# EAGLE board led-controller-hw (EAGLE 7.5.0)
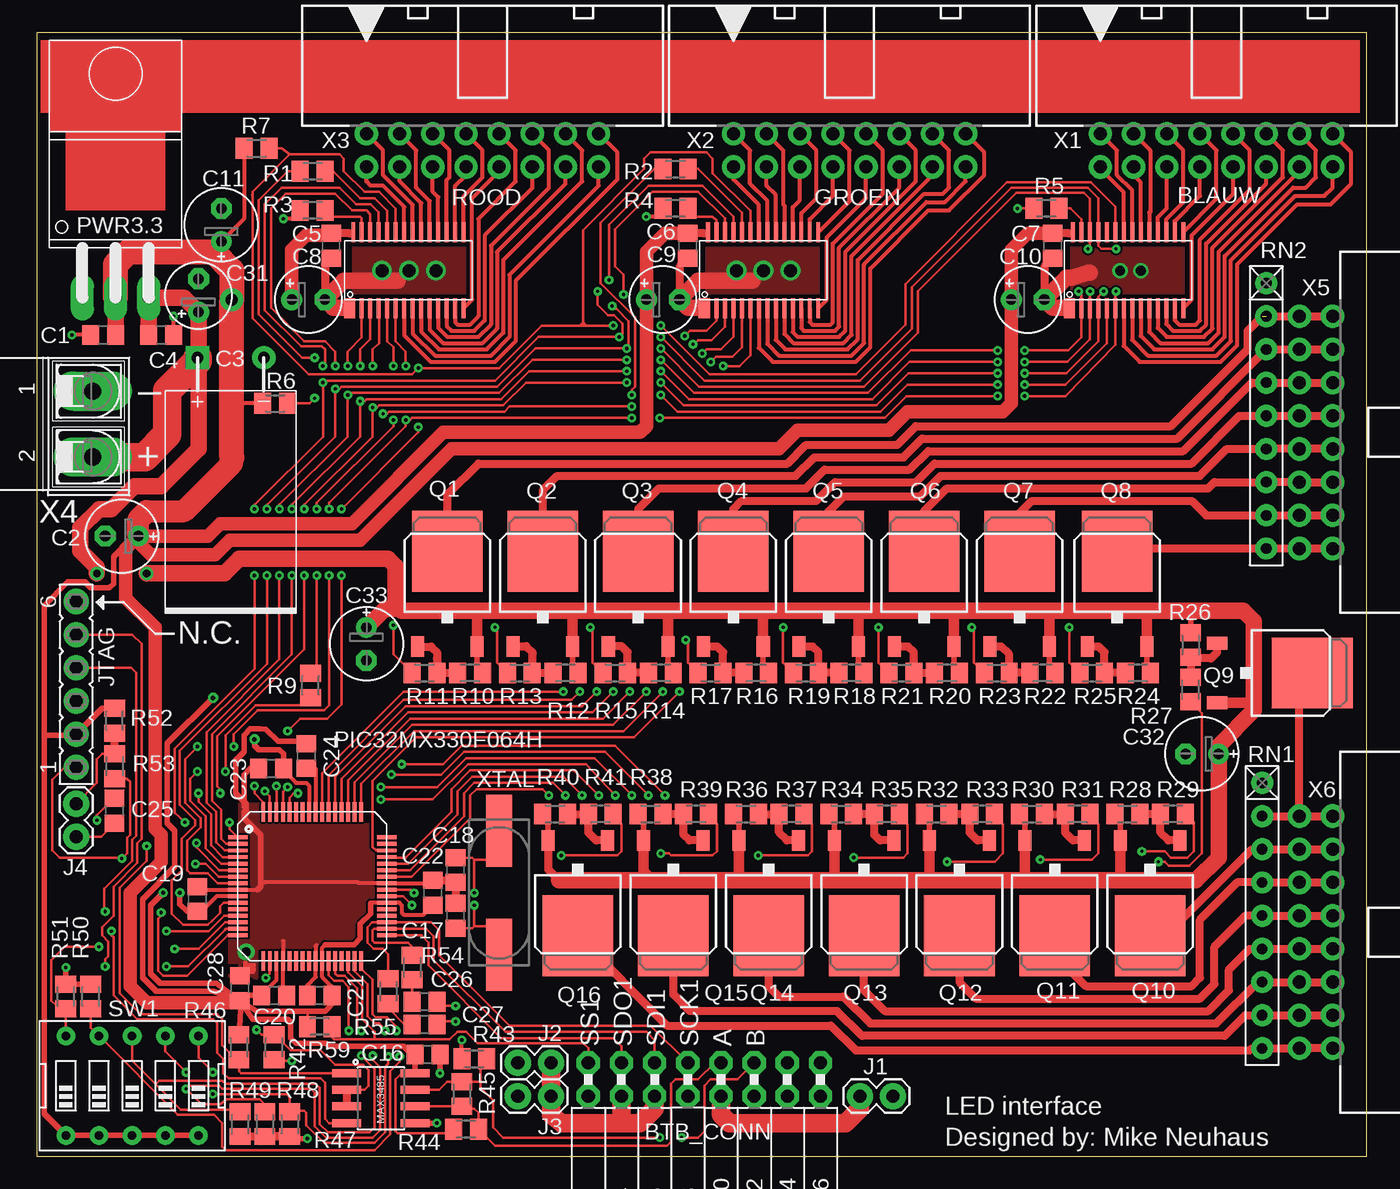
[diagram p2: board, top side]
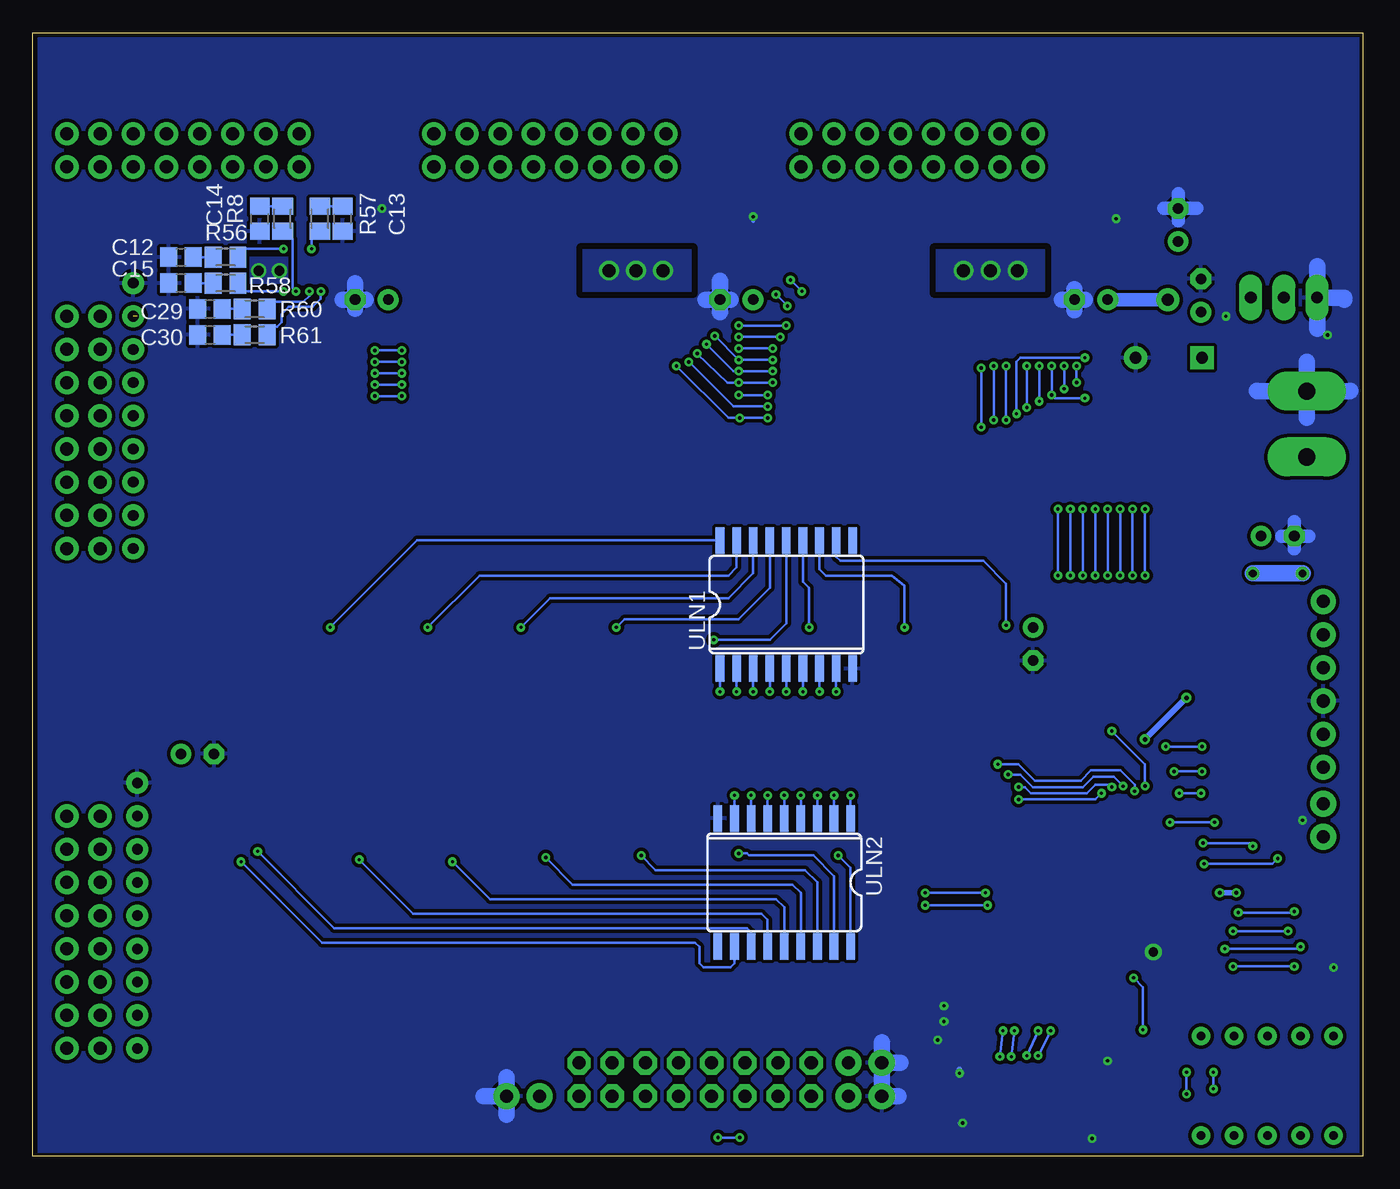
[diagram p3: board, bottom side, seen from below]

Size 101.84 x 86 mm. Coordinates in mm from the lower left corner, seen from the top.
Outline: 0,0 101.84,0 101.84,86 0,86 0,0
Copper layers (1*16): Top 0.035mm / dielectric 1.5mm / Bottom 0.035mm
Design rules "default *": minimum track width 0.15mm, minimum drill 0.25mm, track to track 0.15mm, track to pad 0.15mm, pad to pad 0.15mm, via to via 0.15mm, smd to smd 0.15mm, copper to edge 0.25mm, drill to drill 0.5mm, minimum pad ring 0.35mm, minimum via ring 8mil, stop-mask expansion 4mil, vias tented up to drill 0.25mm, thermal gap 10mil
bRestrict: 12 lines

## Footprints (pad centres in the part's own frame; a part is rotated, then mirrored left to right if it is on the bottom)
TSSOP-28-PWP = smd 1.55 x 0.85: 1 -0.65,9.375 | smd 1.55 x 0.3: 2 -0.65,8.45; 3 -0.65,7.8; 4 -0.65,7.15; 5 -0.65,6.5; 6 -0.65,5.85; 7 -0.65,5.2; 8 -0.65,4.55; 9 -0.65,3.9; 10 -0.65,3.25; 11 -0.65,2.6; 12 -0.65,1.95; 13 -0.65,1.3; 14 -0.65,0.65; 15 5.15,0.65; 16 5.15,1.3; 17 5.15,1.95; 18 5.15,2.6; 19 5.15,3.25; 20 5.15,3.9; 21 5.15,4.55; 22 5.15,5.2; 23 5.15,5.85; 24 5.15,6.5; 25 5.15,7.15; 26 5.15,7.8; 27 5.15,8.45; 28 5.15,9.1
FE08-2W = drill 1 pad 1.778 octagon: 1 -8.89,1.27; 2 -8.89,-1.27; 3 -6.35,1.27; 4 -6.35,-1.27; 5 -3.81,1.27; 6 -3.81,-1.27; 7 -1.27,1.27; 8 -1.27,-1.27; 9 1.27,1.27; 10 1.27,-1.27; 11 3.81,1.27; 12 3.81,-1.27; 13 6.35,1.27; 14 6.35,-1.27; 15 8.89,1.27; 16 8.89,-1.27
C0805 = smd 1.3 x 1.5: 1 -0.95,0; 2 0.95,0
E2,5-6E = drill 0.813 pad 1.575: + -1.27,0 | drill 0.813 pad 1.575 octagon: - 1.27,0
CPOL_EU10-27 = drill 0.9 pad 1.778 square: 1 7.54,-2.54 | drill 0.9 pad 1.778: 2 2.46,-2.54
E2,5-5 = drill 0.813 pad 1.6: + -1.27,0 | drill 0.813 pad 1.6 octagon: - 1.27,0
1X02_LOCK = drill 1 pad 2: 1 0,0; 2 2.54,0
FE06 = drill 1 pad 1.93: 1 -6.35,0; 2 -3.81,0; 3 -1.27,0; 4 1.27,0; 5 3.81,0; 6 6.35,0
SO08 = smd 0.61 x 2.21: 1 -1.905,-2.616; 2 -0.635,-2.616; 3 0.635,-2.616; 4 1.905,-2.616; 5 1.905,2.616; 6 0.635,2.616; 7 -0.635,2.616; 8 -1.905,2.616
TQFP-64-10 = smd 0.3 x 1.5: 1 1.95,0; 2 2.45,0; 3 2.95,0; 4 3.45,0; 5 3.95,0; 6 4.45,0; 7 4.95,0; 8 5.45,0; 9 5.95,0; 10 6.45,0; 11 6.95,0; 12 7.45,0; 13 7.95,0; 14 8.45,0; 15 8.95,0; 16 9.45,0; 33 9.45,11.4; 34 8.95,11.4; 35 8.45,11.4; 36 7.95,11.4; 37 7.45,11.4; 38 6.95,11.4; 39 6.45,11.4; 40 5.95,11.4; 41 5.45,11.4; 42 4.95,11.4; 43 4.45,11.4; 44 3.95,11.4; 45 3.45,11.4; 46 2.95,11.4; 47 2.45,11.4; 48 1.95,11.4 | smd 1.5 x 0.3: 17 11.4,1.95; 18 11.4,2.45; 19 11.4,2.95; 20 11.4,3.45; 21 11.4,3.95; 22 11.4,4.45; 23 11.4,4.95; 24 11.4,5.45; 25 11.4,5.95; 26 11.4,6.45; 27 11.4,6.95; 28 11.4,7.45; 29 11.4,7.95; 30 11.4,8.45; 31 11.4,8.95; 32 11.4,9.45; 49 0,9.45; 50 0,8.95; 51 0,8.45; 52 0,7.95; 53 0,7.45; 54 0,6.95; 55 0,6.45; 56 0,5.95; 57 0,5.45; 58 0,4.95; 59 0,4.45; 60 0,3.95; 61 0,3.45; 62 0,2.95; 63 0,2.45; 64 0,1.95
TO-220 = drill 0.9 pad 1.778 long: 1 0,0; 2 2.54,0; 3 5.08,0
D-PAK_TO252AA = smd 1 x 1.6: 1 -2.28,-4.8; 3 2.28,-4.8 | smd 5.4 x 6.2: 4 0,2.5
M0805 = smd 1.3 x 1.6: 1 -0.95,0; 2 0.95,0
RN-9 = drill 0.813 pad 1.676: 1 -10.16,0; 2 -7.62,0; 3 -5.08,0; 4 -2.54,0; 5 0,0; 6 2.54,0; 7 5.08,0; 8 7.62,0; 9 10.16,0
EDG-05 = drill 0.65 pad 1.422: 1 -5.08,-3.81; 2 -2.54,-3.81; 3 0,-3.81; 4 2.54,-3.81; 5 5.08,-3.81; 6 5.08,3.81; 7 2.54,3.81; 8 0,3.81; 9 -2.54,3.81; 10 -5.08,3.81
SO18L = smd 0.66 x 2.032: 1 -0.635,-4.902; 2 0.635,-4.902; 3 1.905,-4.902; 4 3.175,-4.902; 5 4.445,-4.902; 6 5.715,-4.902; 7 6.985,-4.902; 8 8.255,-4.902; 9 9.525,-4.902; 10 9.525,4.902; 11 8.255,4.902; 12 6.985,4.902; 13 5.715,4.902; 14 4.445,4.902; 15 3.175,4.902; 16 1.905,4.902; 17 0.635,4.902; 18 -0.635,4.902
PAK100/2500-5-16 = drill 1 pad 1.778: 1 -8.89,-1.27; 2 -8.89,1.27; 3 -6.35,-1.27; 4 -6.35,1.27; 5 -3.81,-1.27; 6 -3.81,1.27; 7 -1.27,-1.27; 8 -1.27,1.27; 9 1.27,-1.27; 10 1.27,1.27; 11 3.81,-1.27; 12 3.81,1.27; 13 6.35,-1.27; 14 6.35,1.27; 15 8.89,-1.27; 16 8.89,1.27
AK500/2-H = drill 1.321 pad 3 long: 1 -2.515,0; 2 2.515,0
CSM-7X-DU = smd 5.5 x 2: 1 -4.75,0; 2 4.75,0

## Placement (x,y rotation side)
BLAUW  [TSSOP-28-PWP]  88.42,65.56 90 top
BTB_CONN  [FE08-2W]  51.12,5.87 0 top
C1  100nF  [C0805]  5.08,62.87 180 top
C2  220uF  [E2,5-6E]  6.51,47.47 180 top
C3  680uF  [CPOL_EU10-27]  19.84,58.58 180 top
C4  100nF  [C0805]  9.53,62.87 0 top
C5  100nF  [C0805]  22.54,69.69 270 top
C6  100nF  [C0805]  49.85,69.69 270 top
C7  100nF  [C0805]  77.79,69.69 270 top
C8  1uF  [E2,5-5]  20.8,65.56 0 top
C9  1uF  [E2,5-5]  47.94,65.56 0 top
C10  1uF  [E2,5-5]  75.88,65.56 0 top
C11  220uF  [E2,5-6E]  14.13,71.28 90 top
C12  n.t.b.  [C0805]  90.49,68.82 180 bottom
C13  n.t.b.  [C0805]  78.11,71.75 270 bottom
C14  n.t.b.  [C0805]  84.45,71.75 270 bottom
C15  n.t.b.  [C0805]  90.49,66.83 180 bottom
C16  100nF  [C0805]  29.92,7.78 0 top
C17  22pF  [C0805]  32.07,18.41 270 top
C18  22pF  [C0805]  32.07,21.91 90 top
C19  100nF  [C0805]  12.3,19.68 90 top
C20  100nF  [C0805]  18.18,12.3 0 top
C21  100nF  [C0805]  21.67,12.3 180 top
C22  100nF  [C0805]  30.32,20.16 90 top
C23  100nF  [C0805]  17.94,29.69 180 top
C24  10uF - tantalum/keramisch  [C0805]  20.64,30.64 90 top
C25  100nF  [C0805]  5.95,26.43 90 top
C26  n.t.b.  [C0805]  29.69,11.83 0 top
C27  n.t.b.  [C0805]  29.69,10.08 0 top
C28  10uF/Ker  [C0805]  15.56,12.86 90 top
C29  n.t.b.  [C0805]  88.27,64.85 180 bottom
C30  n.t.b.  [C0805]  88.27,62.87 180 bottom
C31  1uF  [E2,5-5]  12.38,65.88 90 top
C32  220uF  [E2,5-6E]  89.22,30.8 180 top
C33  220uF  [E2,5-6E]  25.24,39.21 270 top
GROEN  [TSSOP-28-PWP]  60.48,65.56 90 top
J1  [1X02_LOCK]  65.56,4.6 180 top
J2  [1X02_LOCK]  39.37,7.14 180 top
J3  [1X02_LOCK]  39.37,4.6 180 top
J4  [1X02_LOCK]  3.02,24.45 90 top
JTAG  [FE06]  3.02,36.12 90 top
MAX3485  RS485SOIC  [SO08]  26.35,4.45 270 top
PIC32MX330F064H  [TQFP-64-10]  15.4,26.35 270 top
PWR3.3  3.3V/3A  [TO-220]  3.49,65.72 0 top
Q1  IRFR5305  [D-PAK_TO252AA]  31.43,43.81 0 top
Q2  IRFR5305  [D-PAK_TO252AA]  38.73,43.81 0 top
Q3  IRFR5305  [D-PAK_TO252AA]  46.04,43.81 0 top
Q4  IRFR5305  [D-PAK_TO252AA]  53.34,43.81 0 top
Q5  IRFR5305  [D-PAK_TO252AA]  60.64,43.81 0 top
Q6  IRFR5305  [D-PAK_TO252AA]  67.95,43.81 0 top
Q7  IRFR5305  [D-PAK_TO252AA]  75.25,43.81 0 top
Q8  IRFR5305  [D-PAK_TO252AA]  82.71,43.81 0 top
Q9  IRFR5305  [D-PAK_TO252AA]  95.17,36.99 270 top
Q10  IRFR5305  [D-PAK_TO252AA]  85.25,19.37 180 top
Q11  IRFR5305  [D-PAK_TO252AA]  77.95,19.37 180 top
Q12  IRFR5305  [D-PAK_TO252AA]  70.64,19.37 180 top
Q13  IRFR5305  [D-PAK_TO252AA]  63.34,19.37 180 top
Q14  IRFR5305  [D-PAK_TO252AA]  56.04,19.37 180 top
Q15  IRFR5305  [D-PAK_TO252AA]  48.74,19.37 180 top
Q16  IRFR5305  [D-PAK_TO252AA]  41.43,19.37 180 top
R1  n.t.b.  [M0805]  21.11,75.41 180 top
R2  n.t.b.  [M0805]  48.9,75.56 180 top
R3  1k9  [M0805]  21.11,72.39 0 top
R4  1k9  [M0805]  48.9,72.55 0 top
R5  1k9  [M0805]  77.31,72.55 0 top
R6  10k  [M0805]  18.26,57.63 180 top
R7  100k  [M0805]  16.83,77.15 180 top
R8  n.t.b.  [M0805]  82.71,71.75 270 bottom
R9  n.t.b.  [M0805]  20.95,36.04 270 top
R10  10k  [M0805]  33.18,36.99 0 top
R11  180  [M0805]  29.69,36.99 180 top
R12  10k  [M0805]  40.48,36.99 0 top
R13  180  [M0805]  36.99,36.99 180 top
R14  10k  [M0805]  47.78,36.99 0 top
R15  180  [M0805]  44.29,36.99 180 top
R16  10k  [M0805]  55.09,36.99 0 top
R17  180  [M0805]  51.59,36.99 180 top
R18  10k  [M0805]  62.39,36.99 0 top
R19  180  [M0805]  58.9,36.99 180 top
R20  10k  [M0805]  69.69,36.99 0 top
R21  180  [M0805]  66.2,36.99 180 top
R22  10k  [M0805]  76.99,36.99 0 top
R23  180  [M0805]  73.5,36.99 180 top
R24  10k  [M0805]  84.3,36.99 0 top
R25  180  [M0805]  80.8,36.99 180 top
R26  10k  [M0805]  88.34,39.13 90 top
R27  180  [M0805]  88.34,35.72 270 top
R28  10k  [M0805]  83.5,26.19 180 top
R29  180  [M0805]  87,26.19 0 top
R30  10k  [M0805]  76.2,26.19 180 top
R31  180  [M0805]  79.69,26.19 0 top
R32  10k  [M0805]  68.9,26.19 180 top
R33  180  [M0805]  72.39,26.19 0 top
R34  10k  [M0805]  61.59,26.19 180 top
R35  180  [M0805]  65.09,26.19 0 top
R36  10k  [M0805]  54.29,26.19 180 top
R37  180  [M0805]  57.79,26.19 0 top
R38  10k  [M0805]  46.99,26.19 180 top
R39  180  [M0805]  50.48,26.19 0 top
R40  10k  [M0805]  39.69,26.19 180 top
R41  180  [M0805]  43.18,26.19 0 top
R42  10k  [M0805]  18.18,8.33 270 top
R43  22k  [M0805]  33.5,7.46 180 top
R44  22k  [M0805]  32.86,2.06 0 top
R45  120  [M0805]  32.54,4.76 90 top
R46  10k  [M0805]  15.48,8.33 90 top
R47  100k  [M0805]  19.37,2.46 90 top
R48  100k  [M0805]  17.46,2.46 90 top
R49  100k  [M0805]  15.56,2.46 90 top
R50  100k  [M0805]  4.13,12.22 270 top
R51  100k  [M0805]  2.22,12.22 270 top
R52  10k  [M0805]  5.95,33.34 270 top
R53  1k  [M0805]  5.95,29.84 90 top
R54  n.t.b.  [M0805]  28.73,14.45 90 top
R55  n.t.b.  [M0805]  26.91,12.62 90 top
R56  n.t.b.  [M0805]  87.07,68.82 0 bottom
R57  n.t.b.  [M0805]  79.85,71.75 270 bottom
R58  n.t.b.  [M0805]  87.07,66.83 0 bottom
R59  100k  [M0805]  21.67,9.92 0 top
R60  n.t.b.  [M0805]  84.85,64.85 0 bottom
R61  n.t.b.  [M0805]  84.85,62.87 0 bottom
RN1  [RN-9]  93.82,18.41 270 top
RN2  [RN-9]  94.14,56.67 270 top
ROOD  [TSSOP-28-PWP]  33.34,65.56 90 top
SW1  [EDG-05]  7.3,5.4 0 top
ULN1  [SO18L]  48.58,42.23 0 bottom
ULN2  [SO18L]  39.85,20.95 180 bottom
X1  2516-5  [PAK100/2500-5-16]  90.33,76.99 0 top
X2  2516-5  [PAK100/2500-5-16]  62.23,76.99 0 top
X3  2516-5  [PAK100/2500-5-16]  34.13,76.99 0 top
X4  [AK500/2-H]  4.29,56.04 270 top
X5  2516-5  [PAK100/2500-5-16]  97.95,55.4 270 top
X6  2516-5  [PAK100/2500-5-16]  97.95,17.14 270 top
XTAL  8MHz  [CSM-7X-DU]  35.4,20.16 270 top

## Tracks (layer width: path | path; a pad name or v marks a point on that pad's centre or on a via)
!SS1
  Top 0.203: BTB_CONN.1 42.23,8.26 41.83,8.65 33.73,8.65 32.86,9.53 32.23,9.53 31.59,8.97 25.96,8.97 | 25.8,8.97 22.78,8.97 22.62,9.13 R59.2 | PIC32MX330F064H.30 23.85,14.09 24.92,13.02 24.92,10.48 25.88,9.53 25.88,9.05 | 25.96,8.97 25.88,9.05 | 25.88,9.05 25.8,8.97 | 25.8,8.97 25.96,8.97
+3V3  (via drill 0.3, 0.35, 0.9 pad 1.78)
  Top 0.203: R59.1 20.72,11.11 | R44.1 31.59,1.75 27.62,1.75 27.46,1.91 27.46,5.87 27.94,6.35 MAX3485.8
  Top 0.3: C22.1 29.6,18.49 28.1,18.49 27.94,18.65 27.94,19.21 27.75,19.4 PIC32MX330F064H.38 25.59,19.4 25.56,19.37 | BLAUW.28 79.29,70.71 79.22,70.64 | 51.31,70.64 GROEN.28 | 19.84,28.57 20.64,28.57 | C21.1 23.02,12.54 21.85,13.71 PIC32MX330F064H.26 21.85,15.97 22.07,16.19 | R7.2 15.88,71.76 C11.+ | R6.2 14.92,57.63 | C20.1 17.31,12.46 18.35,13.5 PIC32MX330F064H.19 | C19.1 12.7,19.05 12.94,19.05 13.79,19.9 PIC32MX330F064H.10 | 20.85,28.36 PIC32MX330F064H.57
  Top 0.305: ROOD.28 24.2,70.71 24.13,70.64 | C23.1 18.89,29.53 19.84,28.57 | 20.64,28.57 20.85,28.36
  Top 0.406: 79.22,70.64 79.06,70.64 | 51.31,70.64 51.12,70.64 | 24.13,70.64 23.97,70.64 | C21.1 22.86,11.9 22.07,11.11 20.72,11.11 16.83,11.11 C28.1 | v9.68,20.16 8.73,19.21 8.73,13.97 9.45,13.26 13.73,13.26 C28.1 | v13.49,35.08 10,31.59 10,25.48 10.56,24.92 10.56,22.15 8.1,19.68 8.1,13.65 9.13,12.62 13.49,12.62 C28.1 | C28.1 16.03,12.3 C20.1 | 16.03,11.91 C28.1 | 15.56,11.43 C28.1 | MAX3485.8 28.97,7.71 C16.1 28.65,7.86 28.1,8.41 22.38,8.41 22.15,8.65 19.84,8.65 19.45,9.05 19.45,10.24 19.21,10.48 16.51,10.48 C28.1 | R46.2 15.64,11.83 C28.1 | SW1.5 SW1.4 SW1.3 SW1.2 SW1.1 0.56,3.25 0.56,32.23 | 0.56,32.23 0.56,42.15 2.38,43.97 3.65,43.97 4.13,43.5 5.56,43.5 5.87,43.81 5.87,45.88 7.46,47.47 C2.+ | v10.95,20.16 10.95,19.29 11.51,18.73 C19.1 | R52.1 5,34.29 JTAG.2 2.94,32.23 0.56,32.23 | 22.07,16.19 24.29,16.19 24.77,16.67 24.77,17.78 25.56,18.57 25.56,19.37 | v16.67,31.91 16.67,31.43 16.99,31.11 18.57,31.11 18.89,30.8 C23.1
  Top 0.41: C23.1
  Top 0.61: 79.06,70.64 C7.1 | 51.12,70.64 C6.1 | 23.97,70.64 C5.1 22.54,70.48
  Top 1.016: C7.1 75.88,70.64 74.61,69.37 C10.+ 74.61,57.63 73.98,56.99 66.68,56.99 65.25,55.56 58.26,55.56 56.83,54.13 31.75,54.13 24.77,47.15 14.76,47.15 13.65,46.04 8.73,46.04 7.78,46.99 C2.+ | C6.1 48.1,70.64 46.67,69.22 C9.+ 46.67,55.88 46.2,55.4 31.12,55.4 24.13,48.42 14.05,48.42 13.1,47.47 C2.+ | 22.54,70.48 20.64,70.48 19.53,69.37 C8.+ | C2.+ 6.83,46.51 6.83,42.7 9.05,40.48 9.05,25.08 9.53,24.61 9.53,22.54 7.14,20.16 7.14,13.02 8.41,11.75 15.4,11.75 C28.1
  Top 1.27: PWR3.3.2 C1.1 | C11.+ 13.57,69.45 13.57,69.14
  Top 1.676: C2.+ 7.78,48.74 8.41,49.37 11.27,49.37 14.92,53.02 14.92,53.5
  Top 1.93: PWR3.3.2 6.03,68.26 6.99,69.22 13.49,69.22 13.57,69.14 14.92,67.79 v14.92,65.56 14.92,57.63 14.92,53.5
  Bottom 0.406: v10.95,20.16 v9.68,20.16
  Bottom 0.41: v13.49,35.08 v16.67,31.91
  Bottom 1.016: C8.+ v14.92,65.56
+5V  (via drill 0.6 pad 1.02)
  Top 0.406: Q1.3 33.71,37.41 arc90 R10.2 | Q2.3 41.02,37.41 arc90 R12.2 | Q3.3 48.32,37.41 arc90 R14.2 | Q4.3 55.62,37.41 arc90 R16.2 | Q5.3 62.92,37.41 arc90 R18.2 | Q6.3 70.23,37.41 arc90 R20.2 | Q7.3 77.53,37.41 arc90 R22.2 | Q8.3 84.99,37.25 arc90 R24.2 | R26.2 88.34,41.67 arc90 88.27,41.75 | Q10.3 82.97,25.78 arc90 R28.2 | Q11.3 75.67,25.78 arc90 R30.2 | Q12.3 68.36,25.78 arc90 R32.2 | Q13.3 61.06,25.78 arc90 R34.2 | 53.76,24.29 53.76,25.78 arc90 R36.2 | Q15.3 46.46,25.78 arc90 R38.2 | Q16.3 39.15,25.78 arc90 R40.2
  Top 0.61: Q8.3 84.99,41.38 84.93,41.43 84.77,41.43 84.46,41.75 | Q14.3 53.76,24.29 53.98,24.29 | 53.76,21.11 53.82,21.11 | 61.06,21.11 61.28,21.11 | 68.36,21.11 68.42,21.11 | 75.67,21.11 75.72,21.11 | 82.97,21.11 83.19,21.11 | Q16.3 39.15,21.96 40.01,21.11
  Top 0.813: PWR3.3.3 8.54,65.72 PWR3.3.3 | 84.46,41.75 84.99,41.22 Q8.3 | Q7.3 77.53,41.75 77.31,41.75 | Q6.3 70.23,41.75 70.33,41.75 | Q5.3 62.92,41.75 63.02,41.75 | Q4.3 55.62,41.75 55.88,41.75 | Q3.3 48.32,41.75 48.26,41.75 | Q2.3 41.02,41.75 40.8,41.75 | Q1.3 33.71,41.75 33.66,41.75 | Q10.3 82.97,21.33 83.19,21.11 | Q15.3 46.46,21.81 47.15,21.11 | Q14.3 53.76,21.49 54.13,21.11 | Q13.3 61.06,21.33 61.28,21.11 | Q12.3 68.36,21.17 68.42,21.11 | Q11.3 75.67,21.49 76.04,21.11 | Q9.3 92.97,34.71 93.19,34.92
  Top 1.27: 40.01,21.11 47.15,21.11 53.82,21.11 54.13,21.11 61.28,21.11 68.42,21.11 75.72,21.11 76.04,21.11 83.19,21.11 88.74,21.11 90.49,22.86 C32.+ 90.49,31.43 93.19,34.13 93.19,34.92 93.19,40.96 92.39,41.75 88.27,41.75 84.46,41.75 77.31,41.75 70.33,41.75 63.02,41.75 55.88,41.75 48.26,41.75 40.8,41.75 33.66,41.75 27.94,41.75 27.78,41.91 | 27.78,41.91 27.46,42.23 27.46,45.16 26.91,45.72 15.48,45.72 14.37,44.61 v8.41,44.61 | C4.1 PWR3.3.3 11.27,65.72 C31.+ 12.38,61.2 C3.1 12.38,61.04 12.38,54.13 9.53,51.28 7.46,51.28 5.72,49.53 4.76,49.53 3.33,48.1 3.33,46.35 4.6,45.09 v4.6,44.61 | C33.+ 26.67,41.91 27.78,41.91
  Top 2.184: X4.2 4.31,53.5 8.26,53.5 10,55.24 10,58.58 12.3,60.88 C3.1
  Bottom 1.27: v4.6,44.61 v8.41,44.61
ANODE_0  (1 unrouted)
  Top 0.61: X5.2 X5.1 93.82,64.29 92.71,63.18 92.71,61.75 86.84,55.88 67.31,55.88 65.88,54.45 58.9,54.45 57.47,53.02 33.81,53.02 31.43,50.64 Q1.4
ANODE_1
  Top 0.61: Q2.4 38.74,50.96 39.85,52.07 58.1,52.07 59.53,53.5 66.36,53.5 67.79,54.93 87.31,54.93 RN2.3 X5.3 X5.4
ANODE_2
  Top 0.61: X5.6 X5.5 RN2.4 93.03,59.21 87.79,53.98 68.26,53.98 66.83,52.55 60.33,52.55 58.9,51.12 47.63,51.12 46.04,49.53 Q3.4
ANODE_3
  Top 0.61: X5.8 X5.7 RN2.5 92.08,56.67 88.42,53.02 68.74,53.02 67.31,51.59 61.12,51.59 59.69,50.16 53.98,50.16 53.34,49.53 Q4.4
ANODE_4
  Top 0.61: X5.10 X5.9 RN2.6 91.12,54.13 89.06,52.07 69.22,52.07 67.63,50.48 61.75,50.48 60.64,49.37 Q5.4
ANODE_5
  Top 0.61: X5.12 X5.11 RN2.7 90.17,51.59 89.69,51.12 69.69,51.12 67.95,49.37 Q6.4
ANODE_6
  Top 0.61: X5.14 X5.13 RN2.8 89.54,49.05 88.42,50.16 76.2,50.16 75.25,49.21 Q7.4
ANODE_7
  Top 0.61: X5.16 X5.15 | 83.19,46.35 83.15,46.31 Q8.4 | 83.82,48.1 82.71,46.99 Q8.4 | X5.15 RN2.9 81.12,46.51 81.44,46.2 81.76,46.2 81.88,46.31 Q8.4 | X5.15 96.48,46.31
ANODE_8
  Top 0.61: X6.1 X6.2 | RN1.2 X6.1 | X6.1 96.68,35.88 96.2,36.35 96.2,36.95 arc-90 Q9.4
ANODE_9
  Top 0.61: 85.25,16.35 Q10.4 86.4,16.87 93.03,23.5 RN1.3 X6.3 X6.4
ANODE_10
  Top 0.61: X6.6 X6.5 RN1.4 91.92,20.95 89.06,18.1 89.06,13.65 88.42,13.02 80.33,13.02 77.95,15.4 Q11.4
ANODE_11
  Top 0.61: X6.8 X6.7 RN1.5 92.55,18.41 90.17,16.03 90.17,13.18 89.06,12.06 71.91,12.06 70.64,13.34 Q12.4
ANODE_12
  Top 0.61: X6.10 X6.9 RN1.6 92.87,15.88 91.28,14.29 91.28,12.7 89.69,11.11 64.93,11.11 63.34,12.7 63.34,16.03 63.18,16.19 63.18,16.71 Q13.4
ANODE_13
  Top 0.61: X6.12 X6.11 RN1.7 93.5,13.34 90.33,10.16 63.82,10.16 61.75,12.22 56.83,12.22 56.04,13.02 Q14.4
ANODE_14
  Top 0.61: X6.14 X6.13 RN1.8 92.55,10.79 90.96,9.21 63.18,9.21 61.28,11.11 50.01,11.11 48.74,12.38 Q15.4
ANODE_15
  Top 0.61: X6.16 X6.15 RN1.9 93.03,8.26 92.87,8.1 62.71,8.1 60.8,10 48.26,10 41.43,16.83 Q16.4
GND  (via drill 0.25, 0.25 pad 0.25, 0.25 pad 0.41, 0.25 pad 0.65, 0.7 pad 1.27, 0.75, 1)
  Top 0.202: C28.2 15.88,13.81 15.88,14.84 16.03,14.84 16.03,14.45 16.19,14.45 | 16.19,14.45 16.19,14.53 | 16.19,14.53 16.19,14.68 16.67,14.68 16.67,14.53 16.19,14.53 | 16.19,14.45 16.19,14.37 16.67,14.37 16.67,14.21 16.11,14.21 16.11,14.05 16.59,14.05 16.59,14.13 15.56,14.13 C28.2 | 5.55,27.3 C25.2 5.4,26.83 5.32,26.83 4.6,26.11 v4.6,25.72
  Top 0.203: 30.56,11.51 v32.07,11.51 | 30.64,10.32 v32.07,10.32 | R42.2 18.41,7.3 v19.53,7.3 | v75.09,72.55 R5.1
  Top 0.254: 18.85,16.47 18.89,16.51 | 21.35,16.11 21.43,16.19
  Top 0.3: C1.2 v2.7,62.87 | C4.2 10.48,63.02 v10.48,64.29 | C22.2 29.8,20.9 PIC32MX330F064H.41 24.66,20.9 arc-90 24.61,20.95 17.46,20.95 arc90 17.15,20.64 | C26.2 30.56,11.51 | C27.2 30.64,10.32 | R4.1 47.31,71.91 v46.67,71.91 | R3.1 19.53,71.75 v18.89,71.75 | C19.2 12.79,20.4 PIC32MX330F064H.9 | R43.2 v32.54,8.89 | C20.2 18.85,12.74 PIC32MX330F064H.20 | C21.2 20.72,13.1 21.35,13.73 PIC32MX330F064H.25
  Top 0.305: C22.2 29.95,21.06 | 21.35,16.11 PIC32MX330F064H.25 | 18.85,16.47 PIC32MX330F064H.20 | PIC32MX330F064H.9 16.9,20.4 | 31.59,21.11 C18.1
  Top 0.406: 15.88,26.04 15.88,25.88 17.15,24.61 17.15,20.64 16.9,20.4 | C23.2 16.35,29.69 15.88,29.21 15.88,26.83 arc90 16.03,26.67 | 16.03,26.67 16.03,26.99 15.24,27.78 15.24,30.08 | 16.03,26.67 16.03,26.19 15.88,26.04 | 15.88,26.35 15.88,26.04 | 20.48,31.91 20.64,31.91 C24.2 20.32,31.59 20.16,31.75 18.49,31.75 17.54,32.7 | MAX3485.5 v30.64,2.54 | C16.2 30.87,6.83 v30.88,6.35 | R50.1 R51.1 v2.22,14.45 | R47.1 19.69,1.35 v20.72,1.35
  Top 0.41: 15.24,30.08 15.24,30.32 15.88,30.96 15.88,32.23 16.35,32.7 17.06,32.7 17.54,32.7
  Top 0.61: C22.2 32.06,21.11 C18.1 C17.1 | BLAUW.1 78.76,64.91 78.74,64.93 | C7.2 77.15,68.11 C10.- | GROEN.1 51.09,64.93 50.8,64.93 | C6.2 49.21,68.11 C9.- | ROOD.1 23.95,64.93 23.65,64.93 | C5.2 22.07,68.27 C8.- | R49.1 R47.1 R48.1
  Top 1.27: 78.74,64.93 77.79,64.93 C10.- 78.82,67.23 79.22,67.23 80.49,67.63 80.65,67.63 | 54.79,66.99 50.64,66.99 C9.- 49.85,64.93 50.8,64.93 | 27.64,66.99 23.5,66.99 C8.- 22.7,64.93 23.65,64.93
  Bottom 0.3: v46.67,71.91 46.67,71.6
  Bottom 0.406: v30.64,2.54 30.8,2.54 | v30.88,6.35 30.88,6.67
  Bottom 1.016: 5.24,46.51 C2.- | C2.- 4.13,47.47 | C2.- 5.24,48.58 | C2.- 6.19,47.47 | C11.- 14.13,73.66 | C11.- 15.24,72.55 | C11.- 14.13,71.6 | C11.- 12.7,72.55
  Bottom 1.27: PWR3.3.1 1.43,65.72 1.43,65.56 | PWR3.3.1 3.49,68.1 | PWR3.3.1 3.49,63.34 | X4.1 4.29,60.8 | X4.1 8.07,58.55 8.1,58.58 | X4.1 4.29,56.52 | X4.1 0.98,58.55 0.95,58.58 | J2.2 35.4,7.14 | 35.56,4.6 J3.2 36.83,8.73 | J1.1 67.31,4.6 | J1.1 65.56,6.03 | J1.1 65.56,3.17 | C9.- 49.21,66.99 | C9.- 50.32,65.56 | C9.- 49.21,64.61 | C9.- 48.42,65.56 | C10.- 78.11,65.56 | C10.- 77.15,64.85 | C10.- 76.36,65.56 | C8.- 22.07,66.36 | C8.- 23.02,65.56 | C8.- 22.07,64.77 | C8.- 21.27,65.56 | C10.- 77.15,66.83
  other vias: 16.03,15.64 82.95,67.79 84.53,67.79 55.64,67.79 53.58,67.79 57.71,67.79 28.5,67.79 26.43,67.79 30.56,67.79
  pour Bottom (isolate 0.254): 0.16,85.5 101.34,85.5 101.34,0.14 0.16,0.14
  pour Top: 16.35,25.4 25.88,25.4 25.88,15.88 16.35,15.88
  pour Top: 16.99,24.77 16.99,26.99 15.48,26.99 15.48,24.77
  pour Top: 16.83,16.51 14.76,16.51 14.76,13.65 16.83,13.65
  pour Top: 79.22,69.53 87.79,69.53 87.79,66.04 79.22,66.04
  pour Bottom: 82.15,68.98 85.33,68.98 85.33,66.67 82.15,66.67
  pour Top: 51.28,69.53 59.85,69.53 59.85,66.04 51.28,66.04
  pour Bottom: 51.28,69.53 59.85,69.53 59.85,66.04 51.28,66.04 51.28,66.2
  pour Top: 24.21,69.53 32.78,69.53 32.78,66.04 24.21,66.04
  pour Bottom: 24.13,69.53 24.13,66.04 32.7,66.04 32.7,69.53
MAIN_BOARD_GND
  Top 1.422: 44.77,2.54 46.2,2.54 47.31,3.65 47.31,4.45 BTB_CONN.6 | BTB_CONN.4 44.77,2.54 | 44.77,2.54 40.16,2.54 39.37,3.17 J3.1 J2.1
MCLR  (via drill 0.25 pad 0.25)
  Top 0.202: v12.14,22.38 12.94,22.38 13.92,21.4 PIC32MX330F064H.7 | JTAG.1 2.14,29.77 1.19,28.81 1.19,23.42 1.75,22.86 6.43,22.86 v6.51,22.78 6.91,23.18 6.91,24.37 7.14,24.61 7.14,28.65 6.9,28.89 R53.1
  Bottom 0.202: v6.51,22.78 6.91,22.38 v12.14,22.38
N$1
  Bottom 0.203: R57.1 C13.1
N$2
  Top 0.61: R10.1 R11.1 30.64,38.1 30.64,38.58 30.2,39.02 Q1.1
N$3
  Top 0.203: ROOD.27 24.89,71.79 24.77,71.91 22.22,71.91
  Top 0.3: 22.22,71.91 R3.2
N$4
  Top 0.203: BLAUW.27 79.97,71.71 79.14,72.55 R5.2
N$5
  Top 0.203: GROEN.27 52.03,71.63 51.75,71.91 50.01,71.91
  Top 0.3: 50.01,71.91 49.85,72.08 R4.2
N$6
  Top 0.3: ROOD.22 28.14,72.67 26.51,74.3 25.56,74.3 25.24,74.61 X3.1
N$7
  Top 0.3: ROOD.21 28.79,72.81 26.51,75.09 26.51,76.99 X3.2
N$8
  Top 0.3: ROOD.20 29.44,72.96 27.78,74.61 X3.3
N$9
  Top 0.3: ROOD.19 30.09,73.1 29.05,74.14 29.05,76.99 X3.4
N$10
  Top 0.3: ROOD.18 30.74,73.4 30.32,73.82 X3.5
N$11
  Top 0.3: ROOD.17 31.39,74.73 31.59,74.93 31.59,76.99 X3.6
N$12
  Top 0.3: ROOD.16 32.04,74.27 32.86,75.09 X3.7
N$13
  Top 0.3: ROOD.15 32.69,73.49 34.13,74.93 34.13,76.99 X3.8
N$14
  Top 0.3: ROOD.14 33.34,65.56 33.34,73.34 35.4,75.41 X3.9
N$15
  Top 0.3: ROOD.13 32.04,63.85 32.23,63.66 33.18,63.66 33.81,64.29 33.81,71.75 36.67,74.61 36.67,76.99 X3.10
N$16
  Top 0.3: ROOD.12 31.39,63.55 31.75,63.18 33.5,63.18 34.29,63.98 34.29,70.48 37.94,74.14 X3.11
N$17
  Top 0.3: ROOD.11 30.74,63.4 31.43,62.71 33.81,62.71 34.77,63.66 34.77,69.69 39.21,74.14 39.21,76.99 X3.12
N$18
  Top 0.3: ROOD.10 30.09,63.26 31.12,62.23 34.13,62.23 35.24,63.34 35.24,69.22 40.48,74.45 X3.13
N$19
  Top 0.3: ROOD.9 29.44,63.11 30.8,61.75 34.45,61.75 35.72,63.02 35.72,68.58 41.75,74.61 41.75,76.99 X3.14
N$20
  Top 0.3: ROOD.8 28.79,62.97 30.48,61.28 34.77,61.28 36.2,62.71 36.2,67.47 43.02,74.3 X3.15
N$21
  Top 0.3: ROOD.7 28.14,62.83 30.16,60.8 35.08,60.8 36.67,62.39 36.67,66.99 44.45,74.77 44.45,76.83 X3.16
N$22
  Top 0.3: GROEN.20 56.58,73.59 55.88,74.3 X2.3
N$23
  Top 0.3: GROEN.22 55.28,72.83 53.34,74.77 X2.1
N$24
  Top 0.3: GROEN.21 55.93,73.13 54.61,74.45 54.61,76.99 X2.2
N$25
  Top 0.203: 57.15,72.87 57.23,72.78
  Top 0.3: X2.4 57.15,76.99 57.15,72.87 | 57.23,72.78 GROEN.19
N$26
  Top 0.3: GROEN.18 57.88,72.65 58.42,73.18 X2.5
N$27
  Top 0.3: GROEN.17 58.53,72.19 59.69,73.34 59.69,76.99 X2.6
N$28
  Top 0.3: GROEN.16 59.18,71.72 60.96,73.5 X2.7
N$29
  Top 0.3: GROEN.15 62.23,73.11 62.23,76.99 X2.8
N$30
  Top 0.3: GROEN.14 60.48,65.56 60.48,70.33 63.5,73.34 X2.9
N$31
  Top 0.3: GROEN.13 59.18,63.85 59.37,63.66 60.8,63.66 60.96,63.82 60.96,69.85 64.77,73.66 64.77,76.99 X2.10
N$32
  Top 0.3: GROEN.12 58.53,63.39 58.74,63.18 61.12,63.18 61.44,63.5 61.44,69.53 66.04,74.14 X2.11
N$33
  Top 0.3: GROEN.11 57.88,63.08 58.26,62.71 61.44,62.71 61.91,63.18 61.91,69.22 67.31,74.61 67.31,76.99 X2.12
N$34
  Top 0.3: GROEN.10 57.23,62.94 57.94,62.23 61.75,62.23 62.39,62.87 62.39,68.9 68.58,75.09 X2.13
N$35
  Top 0.3: GROEN.9 56.58,62.48 57.31,61.75 62.07,61.75 62.87,62.55 62.87,68.58 67.95,73.66 69.37,73.66 69.85,74.14 69.85,76.99 X2.14
N$36
  Top 0.3: GROEN.8 55.93,62.18 56.83,61.28 62.39,61.28 63.34,62.23 63.34,68.26 68.1,73.03 69.53,73.03 71.12,74.61 X2.15
N$37
  Top 0.3: GROEN.7 55.28,61.87 56.36,60.8 62.71,60.8 63.82,61.91 63.82,67.94 68.26,72.39 69.85,72.39 72.55,75.09 72.55,76.83 X2.16
N$38
  Top 0.3: BLAUW.15 90.33,73.27 90.33,76.99 X1.8
N$39
  Top 0.3: BLAUW.7 83.22,62.03 84.46,60.8 90.65,60.8 91.92,62.07 91.92,68.26 96.52,72.87 99.06,72.87 100.65,74.45 100.65,76.83 X1.16
N$40
  Top 0.3: BLAUW.8 83.87,62.49 85.09,61.28 90.33,61.28 91.44,62.39 91.44,68.58 96.36,73.5 98.58,73.5 99.22,74.14 X1.15
N$41
  Top 0.3: BLAUW.9 84.52,62.8 85.57,61.75 90.01,61.75 90.96,62.71 90.96,68.9 96.2,74.14 97.16,74.14 97.95,74.93 97.95,76.99 X1.14
N$42
  Top 0.3: BLAUW.10 85.17,63.1 86.04,62.23 89.69,62.23 90.49,63.02 90.49,69.22 96.68,75.41 X1.13
N$43
  Top 0.3: BLAUW.11 85.82,63.4 86.52,62.71 89.38,62.71 90.01,63.34 90.01,69.53 95.41,74.93 95.41,76.99 X1.12
N$44
  Top 0.3: BLAUW.12 86.47,63.7 87,63.18 89.06,63.18 89.54,63.66 89.54,69.85 94.14,74.45 X1.11
N$45
  Top 0.3: BLAUW.13 87.12,64.01 87.47,63.66 88.74,63.66 89.06,63.98 89.06,70.17 92.87,73.98 92.87,76.99 X1.10
N$46
  Top 0.3: BLAUW.14 88.42,65.56 88.42,70.48 91.6,73.66 X1.9
N$47
  Top 0.3: BLAUW.16 87.12,71.57 89.06,73.5 X1.7
N$48
  Top 0.3: BLAUW.17 86.47,71.71 87.79,73.03 87.79,76.99 X1.6
N$49
  Top 0.3: BLAUW.18 85.82,71.85 86.52,72.55 X1.5
N$50
  Top 0.203: 85.25,72.23 85.17,72.23
  Top 0.3: X1.4 85.25,76.99 85.25,72.23 | 85.17,72.23 BLAUW.19
N$51
  Top 0.3: BLAUW.20 84.52,74.54 83.98,75.09 X1.3
N$52
  Top 0.3: BLAUW.21 83.87,73.92 82.71,75.09 82.71,76.99 X1.2
N$53
  Top 0.3: BLAUW.22 83.22,73.78 81.44,75.56 X1.1
N$54
  Bottom 0.203: R56.1 C12.1
N$55
  Top 0.61: R12.1 R13.1 37.94,38.41 37.94,38.42 37.94,38.58 37.47,39.05 36.51,39.05
  Top 0.813: Q2.1 36.46,39.05 36.51,39.05
N$56
  Top 0.61: R20.1 R21.1 67.15,38.58 66.71,39.02 Q6.1
N$57
  Top 0.61: R15.1 | R14.1 R15.1 | R15.1 45.24,38.58 44.77,39.05 43.8,39.05 Q3.1
N$58  (via drill 0.25 pad 0.25)
  Top 0.203: PIC32MX330F064H.40 28.65,20.4 v28.89,20.16 | C18.2 33.34,22.86 33.5,22.7 | 33.5,22.7 v33.5,20.16 | 35.4,22.7 33.5,22.7
  Top 0.3: XTAL.1 35.4,22.7
  Bottom 0.203: v28.89,20.16 v33.5,20.16
N$59
  Top 0.61: R16.1 R17.1 52.54,38.57 52.55,38.58 52.11,39.02 Q4.1
N$60  (via drill 0.25 pad 0.25)
  Top 0.203: PIC32MX330F064H.39 28.04,19.9 v28.73,19.21 | v33.5,19.21 33.5,17.62 | 33.5,17.62 33.34,17.46 31.75,17.46 | 33.5,17.62 34.61,17.62
  Top 0.305: 31.75,17.46 C17.2 | 34.61,17.62 34.61,15.89 XTAL.2
  Bottom 0.203: v28.73,19.21 v33.5,19.21
N$61
  Top 0.61: R19.1 | R18.1 R19.1 | R19.1 59.85,38.58 59.41,39.02 Q5.1
N$62
  Top 0.202: C25.1 4.92,24.45 J4.1
N$63
  Top 0.61: R22.1 R23.1 74.45,38.42 73.86,39.02 Q7.1
N$64
  Top 0.202: R53.2 5,30.8 4.6,30.4 4.6,28.57 J4.2
  Top 0.61: R53.2 R52.2
N$65
  Top 0.203: R54.1 C26.1
N$66
  Top 0.61: R25.1 | R24.1 R25.1 | R25.1 81.76,38.58 81.32,39.02 Q8.1
N$67
  Top 0.203: 26.91,11.35 28.18,10.08 C27.1
  Top 0.406: R55.1 26.91,11.35
  Top 0.61: R55.1
N$68
  Top 0.203: ROOD.24 26.84,72.38 25.88,73.34 24.77,73.34 22.7,75.41 R1.1
N$69
  Top 0.61: R27.1 R26.1 88.9,38.1 89.93,38.1 90.37,38.54 Q9.1
N$70
  Top 0.203: GROEN.24 53.98,72.22 50.64,75.56 R2.1
N$71
  Bottom 0.203: C14.1 R8.1
N$72
  Top 0.61: R28.1 R29.1 86.04,24.77 86.64,24.17 Q10.1
N$73
  Bottom 0.203: R58.1 C15.1
N$74
  Bottom 0.203: R60.1 C29.1
N$75
  Top 0.61: R30.1 R31.1 78.74,24.77 79.34,24.17 Q11.1
N$76
  Bottom 0.203: R61.1 C30.1
N$77  (via drill 0.25)
  Top 0.2: 11.75,27.23 12.94,26.04 | 12.94,23.57 14.11,22.4
  Top 0.203: v14.45,29.45 14.45,32.23 16.75,34.53 20.64,34.53 R9.2 | 12.94,26.04 12.94,23.57 | PIC32MX330F064H.5 14.11,22.4 | 11.75,27.23 11.75,28.89 v12.3,29.45
  Bottom 0.203: v12.3,29.45 v14.45,29.45
N$78
  Top 0.61: R32.1 R33.1 71.44,24.77 72.04,24.17 Q12.1
N$79  (via drill 0.25)
  Top 0.203: PIC32MX330F064H.46 25.97,23.4 25.72,23.65 25.72,28.73 29.05,32.07 45.72,32.07 v49.21,35.56
  Bottom 0.203: v49.21,35.56 ULN1.1
N$80  (via drill 0.25)
  Top 0.203: PIC32MX330F064H.49 24.85,28.5 28.89,32.54 44.93,32.54 v47.94,35.56
  Bottom 0.203: v47.94,35.56 ULN1.2
N$81
  Top 0.61: R34.1 R35.1 64.14,24.61 64.57,24.17 Q13.1
N$82  (via drill 0.25)
  Top 0.203: PIC32MX330F064H.50 24.35,28.64 28.73,33.02 44.13,33.02 v46.67,35.56
  Bottom 0.203: v46.67,35.56 ULN1.3
N$83  (via drill 0.25)
  Top 0.203: PIC32MX330F064H.51 23.85,28.77 28.58,33.5 43.34,33.5 v45.4,35.56
  Bottom 0.203: v45.4,35.56 ULN1.4
N$84
  Top 0.61: R36.1 R37.1 56.83,24.77 57.43,24.17 Q14.1
N$85  (via drill 0.25)
  Top 0.203: v44.13,35.56 42.55,33.97 28.42,33.97 23.35,28.91 PIC32MX330F064H.52
  Bottom 0.203: v44.13,35.56 ULN1.5
N$86  (via drill 0.25)
  Top 0.203: v42.86,35.56 41.75,34.45 28.26,34.45 22.85,29.04 PIC32MX330F064H.53
  Bottom 0.203: v42.86,35.56 ULN1.6
N$87
  Top 0.61: R38.1 R39.1 49.53,24.61 49.97,24.17 Q15.1
N$88  (via drill 0.25)
  Top 0.203: PIC32MX330F064H.54 22.35,29.18 28.1,34.92 40.96,34.92 v41.59,35.56
  Bottom 0.203: v41.59,35.56 ULN1.7
N$89  (via drill 0.25)
  Top 0.203: PIC32MX330F064H.55 21.85,29.31 28.1,35.56 v40.32,35.56
  Bottom 0.203: v40.32,35.56 ULN1.8
N$90
  Top 0.61: R40.1 R41.1 42.23,24.77 42.83,24.17 Q16.1
N$92  (via drill 0.25)
  Top 0.203: PIC32MX330F064H.42 28.71,21.4 33.18,25.88 33.18,27.62 33.66,28.1 38.74,28.1 v39.21,27.62
  Bottom 0.203: v39.21,27.62 ULN2.1
N$93  (via drill 0.25)
  Top 0.203: PIC32MX330F064H.43 28.57,21.9 32.7,26.04 32.7,27.78 33.5,28.57 39.53,28.57 v40.48,27.62
  Bottom 0.203: v40.48,27.62 ULN2.2
N$94  (via drill 0.25)
  Top 0.203: PIC32MX330F064H.44 28.44,22.4 32.23,26.19 32.23,27.94 33.34,29.05 40.32,29.05 v41.75,27.62
  Bottom 0.203: v41.75,27.62 ULN2.3
N$95  (via drill 0.25)
  Top 0.203: PIC32MX330F064H.45 26.83,22.86 28.26,22.86 31.75,26.35 31.75,28.1 33.18,29.53 41.12,29.53 v43.02,27.62
  Bottom 0.203: v43.02,27.62 ULN2.4
N$96  (via drill 0.25)
  Top 0.203: PIC32MX330F064H.60 19.35,27.45 19.69,27.78 v20,27.78 | v26.35,27.3 30.32,27.3 33.02,30 42.07,30 v44.29,27.62
  Bottom 0.203: v20,27.78 20.48,27.3 v26.35,27.3 | v44.29,27.62 ULN2.5
N$97  (via drill 0.25)
  Top 0.203: PIC32MX330F064H.61 18.85,27.9 v19.21,28.26 | v26.35,28.26 30.64,28.26 32.86,30.48 42.7,30.48 v45.56,27.62
  Bottom 0.203: v19.21,28.26 19.37,28.42 20.48,28.42 21.11,27.78 25.4,27.78 25.88,28.26 v26.35,28.26 | v45.56,27.62 ULN2.6
N$98  (via drill 0.25)
  Top 0.203: PIC32MX330F064H.62 v18.35,28.32 | v27.15,29.21 30.96,29.21 32.7,30.96 43.5,30.96 v46.83,27.62
  Bottom 0.203: v18.35,28.32 18.35,28.35 19.05,29.05 20.64,29.05 21.43,28.26 25.24,28.26 26.19,29.21 v27.15,29.21 | v46.83,27.62 ULN2.7
N$99  (via drill 0.25)
  Top 0.203: PIC32MX330F064H.63 17.85,27.55 v17.46,27.94 | v27.94,30 31.12,30 32.54,31.43 44.29,31.43 v48.1,27.62
  Bottom 0.203: v17.46,27.94 17.46,28.42 18.57,29.53 20.8,29.53 21.59,28.73 25.08,28.73 26.35,30 v27.94,30 | v48.1,27.62 ULN2.8
PGEC1  (via drill 0.25)
  Top 0.2: PIC32MX330F064H.15 14.47,17.4 14.37,17.3
  Top 0.202: 14.37,17.3 11.59,14.53 v9.92,14.53 | 5,17.54 5,16.91 5.48,16.43 5.48,15.32 5.24,15.08 v5.24,14.53
  Top 0.203: JTAG.5 7.3,39.93 8.02,39.21 8.02,24.29 7.7,23.97 7.7,22.46 5.87,20.64 5.87,18.41 5,17.54
  Bottom 0.203: v9.92,14.53 v5.24,14.53
PGED1  (via drill 0.25)
  Top 0.202: 11.35,13.81 9.68,13.81 9.29,14.21 9.29,18.18 9.53,18.41 v9.53,18.65 | 15.32,16.9 14.6,16.9 11.51,13.81 | 7.3,22.62 5.16,20.48 5.16,18.81 v5.24,18.73
  Top 0.203: 11.51,13.81 11.35,13.81 | JTAG.4 7.22,37.39 7.62,36.99 7.62,24.53 7.3,24.21 7.3,22.62
  Top 0.3: PIC32MX330F064H.16 15.32,16.9
  Bottom 0.202: v5.24,18.73 5.32,18.65 v9.53,18.65
ROW_0  (via drill 0.25)
  Top 0.203: v27.31,40.64 27.31,38.42 R11.2
  Bottom 0.203: ULN1.11 40.32,45.88 40.01,45.56 29.05,45.56 27.31,43.81 v27.31,40.64
ROW_1  (via drill 0.25)
  Top 0.203: v35.08,40.48 35.24,40.32 35.24,37.78 R13.2
  Bottom 0.203: ULN1.12 41.59,44.93 41.12,44.45 36.04,44.45 35.08,43.66 v35.08,40.48
ROW_2  (via drill 0.25)
  Top 0.203: v42.39,40.48 42.55,40.32 42.55,37.78 R15.2
  Bottom 0.203: ULN1.13 42.86,43.97 42.39,43.5 v42.39,40.48
ROW_3  (via drill 0.25)
  Top 0.203: v49.69,39.53 49.85,39.37 49.85,37.78 R17.2
  Bottom 0.203: ULN1.14 44.13,40.8 45.4,39.53 v49.69,39.53
ROW_4  (via drill 0.25)
  Top 0.203: v57.15,40.48 57.15,37.78 R19.2
  Bottom 0.203: ULN1.15 45.4,43.5 47.78,41.12 56.52,41.12 v57.15,40.48
ROW_5  (via drill 0.25)
  Top 0.203: v64.45,40.48 64.45,37.78 R21.2
  Bottom 0.203: ULN1.16 46.67,44.61 48.58,42.7 62.23,42.7 v64.45,40.48
ROW_6  (via drill 0.25)
  Top 0.203: v71.6,40.48 71.76,40.32 71.76,37.78 R23.2
  Bottom 0.203: ULN1.17 47.94,45.09 48.58,44.45 67.63,44.45 v71.6,40.48
ROW_7  (via drill 0.25)
  Top 0.203: v79.06,40.48 79.06,37.78 R25.2
  Bottom 0.203: ULN1.18 72.41,47.13 v79.06,40.48
ROW_8  (via drill 0.25)
  Top 0.203: 88.58,34.77 88.42,34.77 R27.2 89.22,33.9 89.22,23.18 88.27,22.23 86.68,22.23 86.36,22.54 v85.88,22.54
  Top 0.3: R27.2 88.74,34.92
  Bottom 0.203: 48.1,16.67 ULN2.11 48.1,14.76 48.42,14.45 50.48,14.45 50.8,14.76 50.8,16.03 51.12,16.35 79.69,16.35 v85.88,22.54
ROW_9  (via drill 0.25)
  Top 0.203: R29.2 88.58,25.56 88.58,23.34 88.11,22.86 86.84,22.86 86.36,23.34 v84.61,23.34
  Bottom 0.203: ULN2.12 46.83,17.14 47.15,17.46 78.74,17.46 v84.61,23.34
ROW_10  (via drill 0.25)
  Top 0.203: v76.84,22.7 80.8,22.7 81.28,23.18 81.28,25.4 R31.2
  Bottom 0.203: ULN2.13 45.56,18.1 46.04,18.57 72.71,18.57 v76.84,22.7
ROW_11  (via drill 0.25)
  Top 0.203: v69.69,22.54 73.34,22.54 73.98,23.18 73.98,25.4 R33.2
  Bottom 0.203: ULN2.14 44.29,19.05 44.93,19.68 66.83,19.68 v69.69,22.54
ROW_12  (via drill 0.25)
  Top 0.203: v62.55,22.86 66.36,22.86 66.68,23.18 66.68,25.4 R35.2
  Bottom 0.203: ULN2.15 43.02,20.16 43.66,20.8 60.48,20.8 v62.55,22.86
ROW_13  (via drill 0.25)
  Top 0.203: v55.25,23.02 59.06,23.02 59.37,23.34 59.37,25.4 R37.2
  Bottom 0.203: ULN2.16 41.75,20.95 42.7,21.91 54.13,21.91 v55.25,23.02
ROW_14  (via drill 0.25)
  Top 0.203: v47.78,23.18 48.42,23.18 48.58,23.02 51.75,23.02 52.07,23.34 52.07,25.4 R39.2
  Bottom 0.203: ULN2.17 40.48,21.43 42.07,23.02 46.99,23.02 47.15,23.18 v47.78,23.18
ROW_15  (via drill 0.25)
  Top 0.203: v40.16,23.02 44.45,23.02 44.77,23.34 44.77,25.4 44.61,25.56 44.61,25.71 R41.2
  Bottom 0.203: ULN2.18 39.21,22.07 v40.16,23.02
RS485_A
  Top 0.203: BTB_CONN.9 51.91,7.14 50.64,5.87 48.9,5.87 48.58,5.56 48.58,1.11 48.26,0.79 35.08,0.79 R44.2 33.81,3.34 33.5,3.65 32.71,3.65 R45.1 MAX3485.6
RS485_ADR_0  (via drill 0.25)
  Top 0.202: PIC32MX330F064H.14 14.41,17.9 12.38,15.88 v10.56,15.88 | R51.2 1.51,11.51 1.11,11.91 1.11,15 2.14,16.03 v4.76,16.03
  Top 0.203: R51.2 SW1.10
  Bottom 0.202: v4.76,16.03 4.92,15.88 v10.56,15.88
RS485_ADR_1  (via drill 0.25 pad 0.25)
  Top 0.202: SW1.9 4.13,9.84 R50.2
  Top 0.203: PIC32MX330F064H.32 24.85,14.36 25.72,13.49 25.72,10.87 25.96,10.64 26.83,10.64 27.54,9.92 v27.54,9.6 | v27.78,7.62 27.78,7.22 27.07,6.51 27.07,1.67 25.88,0.48 14.45,0.48 14.21,0.71 14.21,2.54 13.57,3.17 10.8,3.17 SW1.9
  Bottom 0.203: v27.54,9.6 v27.78,7.62
RS485_ADR_2  (via drill 0.25)
  Top 0.203: 9.09,5.52 11.03,3.57 15.48,3.57 R49.2 | 9.09,5.52 7.3,7.3 SW1.8 | PIC32MX330F064H.27 22.35,13.85 22.78,13.41 23.42,13.41 23.89,12.94 v23.89,9.6 | v24.84,7.7 25.88,6.67 25.88,2.22 25.48,1.83 22.3,1.83 21.67,2.46 21.67,5.24 21.35,5.56 14.45,5.56 14.21,5.79 9.37,5.79 9.09,5.52
  Bottom 0.203: v23.89,9.6 v24.84,7.7
RS485_ADR_3  (via drill 0.25, 0.25 pad 0.25)
  Top 0.203: SW1.7 9.84,8.02 v11.43,6.43 | PIC32MX330F064H.28 arc-90 PIC32MX330F064H.28 22.86,13.97 23.02,13.81 23.57,13.81 24.53,12.86 24.53,9.92 v24.84,9.6 | R48.2 17.46,3.97 17.07,4.37 14.53,4.37 14.05,3.97 12.62,3.97 v11.43,5.16 | 11.67,5.32 v11.43,5.16 | v11.43,5.16 11.67,5.4 13.97,5.4 14.21,5.16 20.96,5.16 21.27,4.84 21.27,2.3 22.15,1.43 25.72,1.43 26.27,1.98 26.27,6.83 25.72,7.38 v25.72,7.7
  Bottom 0.203: v11.43,5.16 v11.43,6.43 | v24.84,9.6 v25.72,7.7
RS485_ADR_4  (via drill 0.25 pad 0.25)
  Top 0.203: v13.49,6.43 12.38,7.54 SW1.6 | PIC32MX330F064H.31 24.35,14.15 25.32,13.18 25.32,10.72 25.88,10.16 26.19,10.16 26.67,9.68 v26.67,9.6 | v26.91,7.62 26.91,7.06 26.67,6.83 26.67,1.83 25.88,1.03 21.99,1.03 20.64,2.38 20.64,3.33 20.48,3.49 19.37,3.49 R47.2 19.37,4.52 19.13,4.76 v13.49,4.76
  Bottom 0.203: v13.49,4.76 v13.49,6.43 | v26.67,9.6 v26.91,7.62
RS485_B  (via drill 0.25 pad 0.25)
  Top 0.203: BTB_CONN.11 53.66,5.87 51.59,5.87 51.12,5.4 51.12,1.91 50.64,1.43 v49.37,1.43 | 33.97,7.3 33.97,5.55 33.97,5.24 34.93,4.29 34.93,2.22 35.72,1.43 v47.7,1.43 | 33.97,7.3 R43.1 | 33.97,7.3 33.97,5.71 R45.2 31.43,5.71 30.8,5.08 MAX3485.7
  Bottom 0.203: v49.37,1.43 v47.7,1.43
RS485_CABLE_GND
  Top 1.422: BTB_CONN.10 52.39,3.17 53.02,2.54 61.91,2.54 63.02,3.65 J1.2
RS485_DI  (via drill 0.25)
  Top 0.202: PIC32MX330F064H.13 14.35,18.4 13.18,17.22 v9.92,17.22 | 7.7,10.48 5.87,12.3 5.87,16.75 5.72,16.91 v5.72,17.22
  Top 0.203: MAX3485.4 22.38,2.54 22.07,2.86 22.07,5.64 21.75,5.95 14.68,5.95 14.29,6.35 14.29,7.46 13.81,7.94 13.81,10.16 13.49,10.48 7.7,10.48
  Bottom 0.202: v5.72,17.22 v9.92,17.22
RS485_DIR  (via drill 0.25)
  Top 0.203: PIC32MX330F064H.18 17.85,13.96 v17.54,13.65 | MAX3485.2 25.08,5.08 25.4,5.4 25.4,6.59 25,6.99 22.86,6.99 21.75,8.1 19.44,8.1 18.34,9.21 R42.1 17.23,9.28 v16.83,9.68
  Top 0.61: MAX3485.2 MAX3485.3
  Bottom 0.203: v17.54,13.65 16.83,12.94 v16.83,9.68
RS485_RO  (via drill 0.25)
  Top 0.202: PIC32MX330F064H.6 13.97,21.91 12.22,23.65 v12.22,23.97 | 7.94,10.87 6.35,12.46 6.35,20.56 8.41,22.62 v8.41,23.73
  Top 0.203: MAX3485.1 15.64,6.35 15.48,6.51 R46.1 15.16,7.38 15.16,7.54 14.21,8.5 14.21,10.48 13.81,10.87 7.94,10.87
  Bottom 0.202: v8.41,23.73 8.65,23.97 v12.22,23.97
SCK1
  Top 0.203: BTB_CONN.7 46.99,10 36.2,10 30.8,15.4 30.8,17.3 30.2,17.9 PIC32MX330F064H.35 25.68,17.9 25.32,17.54 25.32,16.35 25.8,15.88 26.51,15.88 26.91,15.48 R55.2
SDI1
  Top 0.203: BTB_CONN.5 47.31,8.89 46.67,9.53 35.88,9.53 30.4,15 30.4,16.83 29.83,17.4 PIC32MX330F064H.34 25.82,17.4 25.72,17.3 25.72,16.51 25.88,16.35 28.42,16.35 28.65,16.11 R54.2
SDO1
  Top 0.203: PIC32MX330F064H.33 29.45,16.9 30,16.35 30,14.61 35.56,9.05 44.13,9.05 44.77,8.41 BTB_CONN.3
TLC_BLANK  (via drill 0.25, 0.25 pad 0.61)
  Top 0.202: v47.78,60.96 50.32,58.42 50.48,58.42 | 50.01,63.18 51.28,63.18 52.03,63.94
  Top 0.203: v75.64,61.67 78.98,61.67 79.97,62.67 BLAUW.2 79.97,66 v79.77,66.2 | v73.58,61.67 66.91,61.67 63.66,58.42 50.48,58.42 | GROEN.2 52.03,63.94 | 50.01,63.18 v49.61,62.79 | v45.16,60.96 37.94,60.96 35.4,58.42 23.97,58.42 v23.81,58.26 23.81,55.09 18.57,49.85 v18.57,49.53 | R6.1 20.87,57.62 v21.27,58.02 | v23.81,60.48 23.81,61.59 24.89,62.67 ROOD.2 | PIC32MX330F064H.3 14.38,23.4 13.73,24.05 13.73,26.35 13.02,27.07 13.02,32.46 18.57,38.02 v18.57,44.45
  Bottom 0.203: v75.64,61.67 v73.58,61.67 | v45.16,60.96 v47.78,60.96 v49.61,62.79 | v18.57,49.53 v18.57,44.45 | v23.81,60.48 v23.81,58.26 23.57,58.02 v21.27,58.02 | v79.77,66.2 79.77,65.64 80.41,65.01 82.23,65.01 82.79,64.45 82.79,63.82 83.11,63.5 83.98,63.5 83.98,62.94 R61.2
TLC_DCPRG  (via drill 0.25, 0.25 pad 0.61)
  Top 0.202: v47.78,61.83 50.72,58.9 50.88,58.9 | v45.16,61.83 45.32,61.99 45.32,63.9 44.37,64.85 44.13,64.85 44.05,64.93 v44.05,65.09 | 10.95,31.04 10.95,26.91 12.14,25.72 12.14,25.32 11.11,24.29 11.11,21.91 | 13.41,18.02 14.05,18.65 14.05,19.13 14.32,19.4 PIC32MX330F064H.11
  Top 0.203: 50.88,58.9 63.34,58.9 67.47,63.02 67.47,66.2 75.01,73.74 80.17,73.74 80.62,73.28 BLAUW.26 80.62,69.59 v80.49,69.45 | GROEN.26 52.68,71.78 50.64,73.82 47.15,73.82 44.29,70.96 44.29,68.1 44.93,67.47 v44.93,65.96 | v45.16,61.83 38.18,61.83 35.24,58.9 23.34,58.9 23.18,58.74 v22.86,58.74 22.86,55.09 17.62,49.85 v17.62,49.53 | ROOD.26 25.54,72.09 25.24,72.39 24.13,72.39 22.86,73.66 19.05,73.66 17.94,72.55 17.94,64.93 20.48,62.39 22.07,62.39 22.86,61.59 v22.86,60.48 | 10.95,31.04 17.62,37.7 v17.62,44.45 | 11.11,21.91 10.32,21.11 10.32,18.57 11.19,17.7 13.1,17.7 13.41,18.02
  Bottom 0.203: v47.78,61.83 v45.16,61.83 | v44.05,65.09 v44.93,65.96 | v17.62,49.53 v17.62,44.45 | v22.86,60.48 v22.86,58.74 | v80.49,69.45 80.49,70.73 80.33,70.81 R57.2
TLC_G_OUT  (via drill 0.25 pad 0.61)
  Top 0.202: v45.56,58.26 45.56,58.66 45.8,58.9 | v47.78,58.26 49.05,56.99 49.21,56.99
  Top 0.203: BLAUW.5 81.92,62.24 78.74,59.05 v75.64,59.05 | v73.58,59.05 66.68,59.05 64.61,56.99 49.21,56.99 | 45.8,58.9 45.8,64.21 43.18,66.83 43.18,71.44 47.31,75.56 R2.2
  Bottom 0.203: v75.64,59.05 v73.58,59.05 | v47.78,58.26 v45.56,58.26
TLC_GSCLK  (via drill 0.25, 0.25 pad 0.61)
  Top 0.202: v47.78,62.71 51.12,59.37 51.28,59.37 | 38.42,62.71 v44.61,62.71 44.85,62.94 44.85,63.74 44.21,64.37 43.74,64.37 42.94,65.17 v42.94,66.2 | PIC32MX330F064H.1 14.76,25.04 v14.76,25.56 | v11.35,25.56 10.56,26.27 10.56,31.19
  Top 0.203: 51.28,59.37 63.02,59.37 66.99,63.34 66.99,66.52 74.61,74.14 80.49,74.14 81.28,73.34 BLAUW.25 81.27,69.7 81.52,69.45 v82.63,69.45 | GROEN.25 53.34,71.91 50.96,74.3 46.83,74.3 43.82,71.28 v43.82,67.07 | 38.42,62.71 35.08,59.37 22.23,59.37 22.07,59.21 v21.91,59.21 21.91,55.09 16.67,49.85 v16.67,49.53 | ROOD.25 26.19,72.24 25.56,72.87 24.45,72.87 23.18,74.14 18.73,74.14 17.46,72.87 17.46,64.77 20.24,61.99 21.83,61.99 22.07,61.75 22.07,60.64 v21.91,60.48 | v16.67,44.45 16.67,37.78 16.67,37.31 10.56,31.19
  Top 0.3: GROEN.25
  Bottom 0.202: v42.94,66.2 v43.82,67.07 | v11.35,25.56 v14.76,25.56
  Bottom 0.203: v47.78,62.71 v44.61,62.71 | v16.67,49.53 v16.67,44.45 | v21.91,59.21 v21.91,60.48 | v82.63,69.45 85.57,69.45 R56.2
TLC_R_OUT  (via drill 0.25, 0.25 pad 0.61)
  Top 0.202: v51.59,60.8 51.99,61.2 53.26,61.2 53.98,61.92
  Top 0.203: GROEN.5 53.98,61.92 | v45.56,57.39 36.2,57.39 35.8,56.99 26.99,56.99 26.83,56.83 v26.51,56.83 | v21.27,61.12 20.32,61.12 16.99,64.45 16.99,73.18 19.21,75.41 R1.2
  Bottom 0.203: v51.59,60.8 48.18,57.39 v45.56,57.39 | v26.51,56.83 26.51,60.8 26.19,61.12 v21.27,61.12
TLC_R_SIN  (via drill 0.25)
  Top 0.202: 21.43,49.85 21.43,50.01 27.31,55.88 v27.31,56.36
  Top 0.203: v27.31,60.48 27.31,61.91 26.83,62.39 26.83,64.91 ROOD.5 | v21.43,49.53 21.43,49.85 | 27.31,56.2 v27.31,56.36 | R9.1 21.43,36.99 v21.43,44.45
  Bottom 0.203: v27.31,60.48 v27.31,56.36 | v21.43,49.53 v21.43,44.45
TLC_SCLK  (via drill 0.25, 0.25 pad 0.61)
  Top 0.202: v47.78,59.21 49.53,57.47 49.69,57.47 | v50.96,61.44 51.28,61.75 52.38,61.75 53.33,62.71 | 13.34,26.19 12.38,27.15 v12.38,27.78 | 13.81,28.34 14.05,28.1 v14.05,27.78
  Top 0.203: v75.64,59.93 78.82,59.93 81.27,62.38 BLAUW.4 81.27,65.8 v81.68,66.2 | v73.58,59.93 66.75,59.93 64.29,57.47 49.69,57.47 | 53.34,62.71 53.33,62.71 GROEN.4 | v45.16,59.21 37.47,59.21 35.72,57.47 26.19,57.47 26.04,57.31 v25.72,57.31 25.72,55.09 20.48,49.85 v20.48,49.53 | v25.72,60.48 25.72,61.75 26.19,62.23 ROOD.4 | 13.81,28.34 13.81,32.15 20.48,38.81 v20.48,44.45 | PIC32MX330F064H.4 14.25,22.9 13.34,23.81 13.34,26.19
  Top 0.3: GROEN.4
  Bottom 0.203: v75.64,59.93 v73.58,59.93 | v45.16,59.21 v47.78,59.21 48.66,59.21 v50.96,61.44 | v20.48,49.53 v20.48,44.45 | v25.72,57.31 v25.72,60.48 | v12.38,27.78 v14.05,27.78 | R8.2 82.39,70.81 82.39,70.64 81.92,70.17 81.92,66.44 v81.68,66.2
TLC_VPRG  (via drill 0.25, 0.25 pad 0.61)
  Top 0.202: v52.55,60.48 53.82,60.48 54.63,61.3 | v28.26,56.36 28.26,55.88 22.38,50.01 v22.38,49.53 | 11.35,30.4 11.35,27.07 12.54,25.88 12.54,25.16 11.51,24.13 11.51,21.91 11.75,21.67 13.1,21.67 13.86,20.9
  Top 0.203: v75.64,58.18 78.74,58.18 82.57,62.09 BLAUW.6 82.57,66.14 v82.63,66.2 | v73.58,58.18 66.6,58.18 64.93,56.52 v47.7,56.52 | GROEN.6 54.63,61.3 | v45.56,56.52 28.73,56.52 28.58,56.36 v28.26,56.36 | v28.26,60.48 28.26,61.59 27.49,62.37 ROOD.6 | v22.38,49.53 22.38,49.85 | v15.08,31.35 15.08,32.31 16.91,34.13 21.99,34.13 22.38,34.53 v22.38,44.45 | v12.3,31.35 11.35,30.4 | PIC32MX330F064H.8 13.86,20.9
  Bottom 0.202: v12.3,31.35 v15.08,31.35
  Bottom 0.203: v75.64,58.18 v73.58,58.18 | v45.56,56.52 v47.7,56.52 48.58,56.52 v52.55,60.48 | v28.26,56.36 v28.26,60.48 | v22.38,49.53 v22.38,44.45 | v82.63,66.2 83.82,66.2 85.8,66.2 R58.2
TLC_XERR  (via drill 0.25, 0.25 pad 0.61)
  Top 0.202: v47.78,63.58 51.51,59.85 | v44.13,63.58 42.07,63.58 41.83,63.58 41.59,63.58 38.66,63.58 35.4,60.33 | v29.21,55.8 29.21,55.4 v23.34,49.53
  Top 0.203: 51.51,59.85 62.71,59.85 66.52,63.66 66.52,66.75 74.3,74.53 80.72,74.53 82.57,72.68 BLAUW.23 | GROEN.23 54.63,72.37 51.75,75.25 51.75,76.36 51.28,76.83 46.99,76.83 46.51,76.36 46.51,75.56 41.83,70.88 41.83,63.84 | 41.83,63.84 41.83,63.82 | 41.83,63.82 41.83,63.58 | ROOD.23 27.49,72.53 26.19,73.82 25.08,73.82 23.5,75.41 23.5,76.36 23.18,76.68 19.37,76.68 | 19.37,76.68 16.51,73.82 | 16.51,73.82 16.51,64.14 20.8,59.85 28.73,59.85 v29.21,60.33 35.4,60.33 | 16.51,73.5 16.51,73.82 | 17.35,26.94 17.35,27.1 16.67,27.78 v16.67,28.34 | 41.83,63.84 41.59,63.6 41.59,63.58 42.07,63.58 41.83,63.82 | R7.1 18.73,77.15 19.37,76.68 | v23.34,44.45 23.34,34.61 22.23,33.5 20.16,33.5 v19.21,32.54
  Top 0.3: PIC32MX330F064H.64 17.35,26.94
  Bottom 0.203: v47.78,63.58 v44.13,63.58 | v29.21,60.33 v29.21,55.8 | v23.34,49.53 v23.34,44.45 | v19.21,32.54 16.67,30 v16.67,28.34
TLC_XLAT  (via drill 0.25, 0.25 pad 0.61)
  Top 0.202: v47.78,60.09 49.93,57.94 50.09,57.94 | v50.24,62.15 50.32,62.15 50.64,62.47 51.67,62.47 52.68,63.48
  Top 0.203: v75.64,60.8 78.9,60.8 80.62,62.53 BLAUW.3 80.62,66.18 v80.65,66.2 | v73.58,60.8 66.83,60.8 63.98,57.94 50.09,57.94 | GROEN.3 52.68,63.48 | ROOD.3 25.54,62.53 24.77,61.75 v24.77,60.48 | v19.53,49.53 19.53,49.85 24.77,55.09 v24.77,57.78 25.08,57.78 25.24,57.94 35.56,57.94 37.7,60.09 v45.16,60.09 | PIC32MX330F064H.2 14.52,23.9 14.13,24.29 14.13,26.51 13.41,27.23 13.41,32.31 19.53,38.42 v19.53,44.45
  Bottom 0.203: v75.64,60.8 v73.58,60.8 | v45.16,60.09 v47.78,60.09 48.18,60.09 v50.24,62.15 | v19.53,49.53 v19.53,44.45 | v24.77,57.78 v24.77,60.48 | R60.2 83.9,65.16 83.82,65.25 83.82,65.41 81.12,65.41 80.65,65.88 v80.65,66.2
VCAP
  Top 0.3: C24.1 21.35,29.69 PIC32MX330F064H.56
(copper drawn outside any net)
  shapes: Top area x1

## Text on the board
tPlace: LED interface | Designed by: Mike Neuhaus
tNames: _ | + | N.C. | SS1 | SDO1 | SDI1 | SCK1 | A | B